# EAGLE design reflow_oven_TUE11_24_March_2023 (EAGLE 9.6.2)
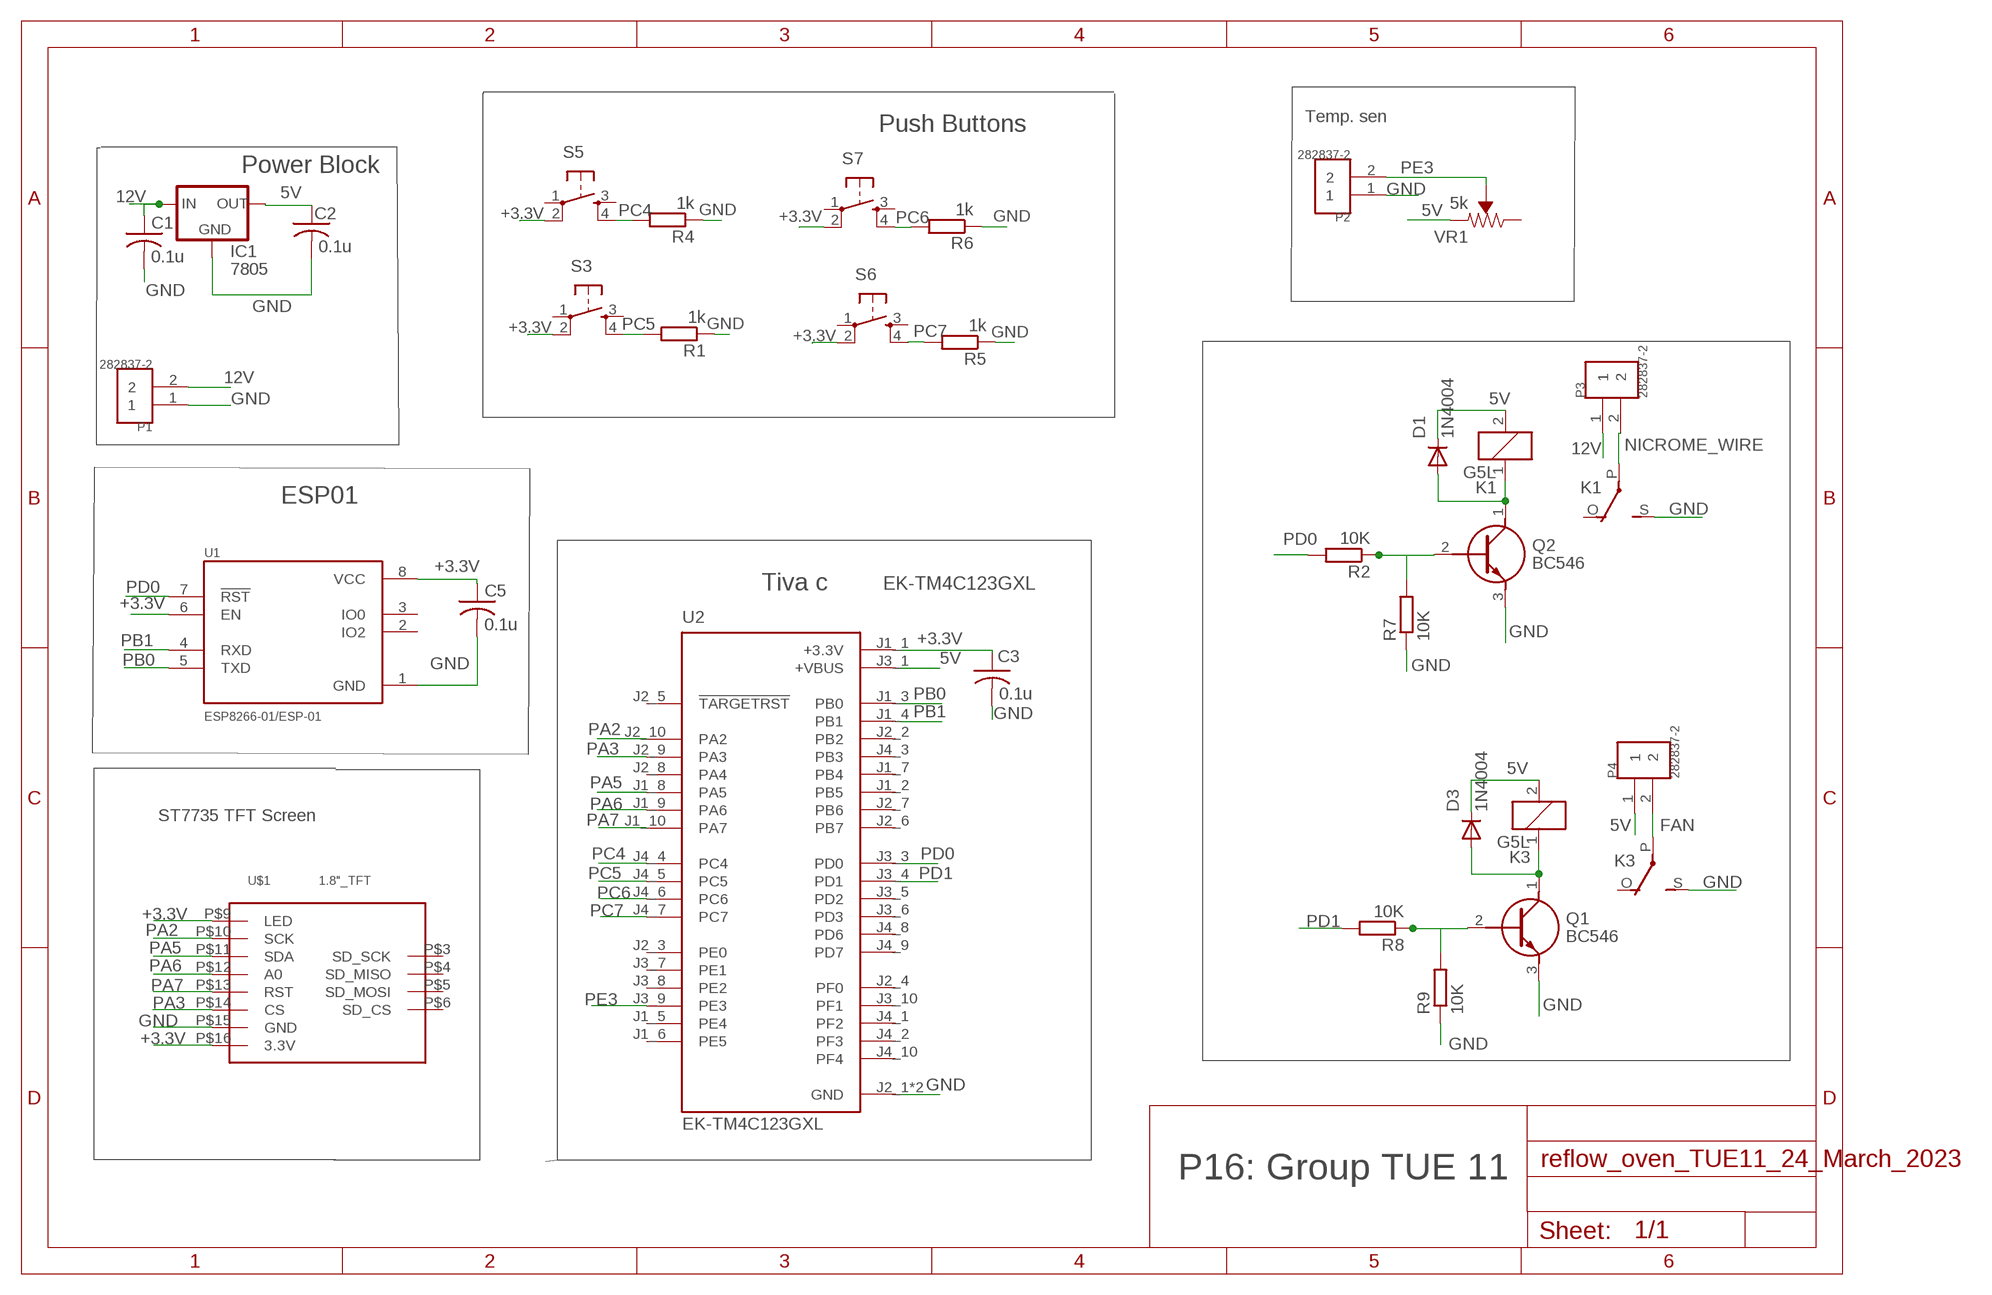
[diagram p0: schematic, sheet 1]

## Parts
C1  0.1u  C-USC1206  [C1206]
C2  0.1u  C-USC1206  [C1206]
C3  0.1u  C-USC1206  [C1206]
C5  0.1u  C-USC1206  [C1206]
D1  1N4004  [DO41-10]
D3  1N4004  [DO41-10]
IC1  7805  [78XXS]
K1  G5L  [G5LE]
K3  G5L  [G5LE]
P1  282837-2  [TE_282837-2]
P2  282837-2  [TE_282837-2]
P3  282837-2  [TE_282837-2]
P4  282837-2  [TE_282837-2]
Q1  BC546  [BC546]
Q2  BC546  [BC546]
R1  1k  R-EU_R1206  [R1206]
R2  10K  R-EU_R1206  [R1206]
R4  1k  R-EU_R1206  [R1206]
R5  1k  R-EU_R1206  [R1206]
R6  1k  R-EU_R1206  [R1206]
R7  10K  R-EU_R1206  [R1206]
R8  10K  R-EU_R1206  [R1206]
R9  10K  R-EU_R1206  [R1206]
S3  TAC_SWITCHPTH  [TACTILE-PTH]
S5  TAC_SWITCHPTH  [TACTILE-PTH]
S6  TAC_SWITCHPTH  [TACTILE-PTH]
S7  TAC_SWITCHPTH  [TACTILE-PTH]
U1  ESP8266-01/ESP-01  [XCVR_ESP8266-01/ESP-01]
U2  EK-TM4C123GXL  [MODULE_EK-TM4C123GXL]
U$1  1.8"_TFT  [1.8"_TFT]
VR1  5k  TRIMPOT-PTH-10MM-KNOB-1/2W-10%  [TRIMPOT-PTH-3386U]

## Nets
5V: C2.1 D1.C D3.C IC1.OUT K1.2 K3.2 P4.1 U2.J3_1(+VBUS) VR1.1(CCW)
12V: C1.1 IC1.IN P1.2 P3.1
+3.3V: C3.1 C5.1 S3.2 S5.2 S6.2 S7.2 U1.6(EN) U1.8(VCC) U2.J1_1(+3.3V) U$1.P$9(LED) U$1.P$16(3.3V)
FAN: K3.P(2:P) P4.2
GND: C1.2 C2.2 C3.2 C5.2 IC1.GND K1.S(2:S) K3.S(2:S) P1.1 P2.1 Q1.3(E) Q2.3(E) R1.1 R4.1 R5.1 R6.1 R7.1 R9.1 U1.1(GND) U2.J2_1(GND) U2.J3_2(GND) U$1.P$15(GND)
N$1: Q2.2(B) R2.1 R7.2
N$2: D1.A K1.1 Q2.1(C)
N$3: Q1.2(B) R8.1 R9.2
N$4: D3.A K3.1 Q1.1(C)
NICROME_WIRE: K1.P(2:P) P3.2
PA2: U2.J2_10(PA2) U$1.P$10(SCK)
PA3: U2.J2_9(PA3) U$1.P$14(CS)
PA5: U2.J1_8(PA5) U$1.P$11(SDA)
PA6: U2.J1_9(PA6) U$1.P$12(A0)
PA7: U2.J1_10(PA7) U$1.P$13(RST)
PB0: U1.5(TXD) U2.J1_3(PB0)
PB1: U1.4(RXD) U2.J1_4(PB1)
PC4: R4.2 S5.4 U2.J4_4(PC4)
PC5: R1.2 S3.4 U2.J4_5(PC5)
PC6: R6.2 S7.4 U2.J4_6(PC6)
PC7: R5.2 S6.4 U2.J4_7(PC7)
PD0: R2.2 U1.7(!RST) U2.J3_3(PD0)
PD1: R8.2 U2.J3_4(PD1)
PE3: P2.2 U2.J3_9(PE3) VR1.2(WIPER)
Unconnected: K1.O(2:O) K3.O(2:O) S3.1 S3.3 S5.1 S5.3 S6.1 S6.3 S7.1 S7.3 U1.2(IO2) U1.3(IO0) U2.J1_2(PB5) U2.J1_5(PE4) U2.J1_6(PE5) U2.J1_7(PB4) U2.J2_2(PB2) U2.J2_3(PE0) U2.J2_4(PF0) U2.J2_5(!TARGETRST) U2.J2_6(PB7) U2.J2_7(PB6) U2.J2_8(PA4) U2.J3_5(PD2) U2.J3_6(PD3) U2.J3_7(PE1) U2.J3_8(PE2) U2.J3_10(PF1) U2.J4_1(PF2) U2.J4_2(PF3) U2.J4_3(PB3) U2.J4_8(PD6) U2.J4_9(PD7) U2.J4_10(PF4) U$1.P$3(SD_SCK) U$1.P$4(SD_MISO) U$1.P$5(SD_MOSI) U$1.P$6(SD_CS) VR1.3(CW)

## Notes on the sheet
- Temp. sen
- Push Buttons
- Power Block
- ESP01
- Tiva c | EK-TM4C123GXL
- ST7735 TFT Screen
- P16: Group TUE 11

## Library data of the parts
C1-C3 C5 = adafruit:C-US: CAPACITOR, American symbol
D1 D3 = adafruit:1N4004: DIODE General purpose 1N400x type rectifier (With bigger pads) http://www.ladyada.net/library/pcb/eaglelibrary.html
IC1 = BASIC_Components:7805
K1 K3 = relay:G5L: RELAY 1 x switch, 10 A/120 V AC, 8 A/30 V ADC, Omron; OC_FARNELL: unknown; OC_NEWARK: unknown
P1-P4 = 282837-2:282837-2: TERM BLOCK 5.08MM 2POS SIDE ENTY Check availability <https://pricing.snapeda.com/parts/282837-2/TE%20Connectivity/view-part?ref=eda>; AVAILABILITY: In Stock; COMMENT: 282837-2; DESCRIPTION: Connector Terminal Blocks Receptacle 2 Position 5.08mm Solder Straight Thru-Hole 13.5A/Contact; MF: TE Connectivity; MP: 282837-2; PACKAGE: None; PRICE: None; PURCHASE-URL: https://pricing.snapeda.com/search/part/282837-2/?ref=eda
Q1 Q2 = BC546:BC546: TRANSISTOR, NPN, TO-92 Source: Datasheet <https://www.onsemi.com/pdf/datasheet/bc550-d.pdf>; DESCRIPTION: TRANSISTOR, NPN, TO-92; HEIGHT: 5.33mm; MANUFACTURER_NAME: onsemi; MANUFACTURER_PART_NUMBER: BC546; MOUSER_PART_NUMBER: 512-BC546; MOUSER_PRICE-STOCK: https://www.mouser.co.uk/ProductDetail/onsemi-Fairchild/BC546?qs=UMEuL5FsraDWGn9zuahUkw%3D%3D
R1 R2 R4-R9 = IIT_BOMBAY_Racing2:R-EU_: RESISTOR, European symbol
S3 S5-S7 = SparkFun-Retired:TAC_SWITCH: Momentary Switch Button commonly used for reset or general input. Spark Fun Electronics SKU : COM-00097 SMT- SWCH-08247
U1 = ESP8266-01_ESP-01:ESP8266-01/ESP-01: MakerFocus 4pcs ESP8266 ESP-01 Serial Wireless WiFi Transceiver Receiver Module 1MB SPI Flash DC3.0-3.6V Internet of Things WiFi Module Board Compatible with Ar duino Check availability <https://pricing.snapeda.com/parts/ESP8266-01/ESP-01/AI-Thinker/view-part?ref=eda>; AVAILABILITY: Not in stock; DESCRIPTION: MakerFocus 4pcs ESP8266 ESP-01 Serial Wireless WiFi Transceiver Receiver Module 1MB SPI Flash DC3.0-3.6V Internet of Things WiFi Module Board Compatible with Ar duino; MF: AI-Thinker; MP: ESP8266-01/ESP-01; PACKAGE: Non-Standard AI-Thinker; PRICE: None
U2 = EK-TM4C123GXL:EK-TM4C123GXL: ARM® Cortex®-M4F Based MCU TM4C123G LaunchPad™ Evaluation Kit Check availability <https://pricing.snapeda.com/parts/EK-TM4C123GXL/Texas%20Instruments/view-part?ref=eda>; AVAILABILITY: In Stock; DESCRIPTION: ARM® Cortex®-M4F Based MCU TM4C123G LaunchPad™ Evaluation Kit; MF: Texas Instruments; MP: EK-TM4C123GXL; PACKAGE: None; PRICE: None; PURCHASE-URL: https://pricing.snapeda.com/search/part/EK-TM4C123GXL/?ref=eda
U$1 = tft_1_8_1_44_oled_0_96:1.8"_TFT
VR1 = SparkFun-Resistors:TRIMPOT: Trimming Potentiometer (Trimpot) Three-terminal potentiometers, with an adjustable wiper and two adjustable resistors. A pot can be used to create a configurable voltage divider, or as a variable resistor. "Trimpots" are a subset of potentiometers, usually intended for "set-and-forget" applications. They're often more delicate than standard potentiometers - rated for fewer turns. Variants PTH-KNOB - PTH Trimpot w/ finger-adjustable knob Trimpot 10K with Knob <https://www.sparkfun.com/products/9806> (COM-09806) Datasheet <http://www.sparkfun.com/datasheets/Components/General/TSR-3386.pdf> SMD-3MM-CLOSED-FRAME - SMD 3mm Square Closed-Frame Trimpot Used on e.g. EasyDriver - Stepper Motor Driver <https://www.sparkfun.com/products/12779> Datasheet <http://www.bitechnologies.com/pdfs/22.pdf> (22AR10KTR) SMD-5MM - SMD 5mm Square Closed-Frame Trimpot Used on e.g. IOIO-OTG - V2.2 <https://www.sparkfun.com/products/13613> Datasheet <http://www.vishay.com/docs/51008/ts53.pdf> (TS53YL502MR10) SMD-3MM-1/10W-25% - 3mm Square Open-Frame Trimpot Used on e.g. SparkFun Shapeoko <https://www.sparkfun.com/products/13899> Datasheet <http://www.bourns.com/docs/Product-Datasheets/TC33.pdf> (TC33X-2-103E); PROD_ID: RES-09730; SF_SKU: COM-09806; VALUE: 10k

## Board
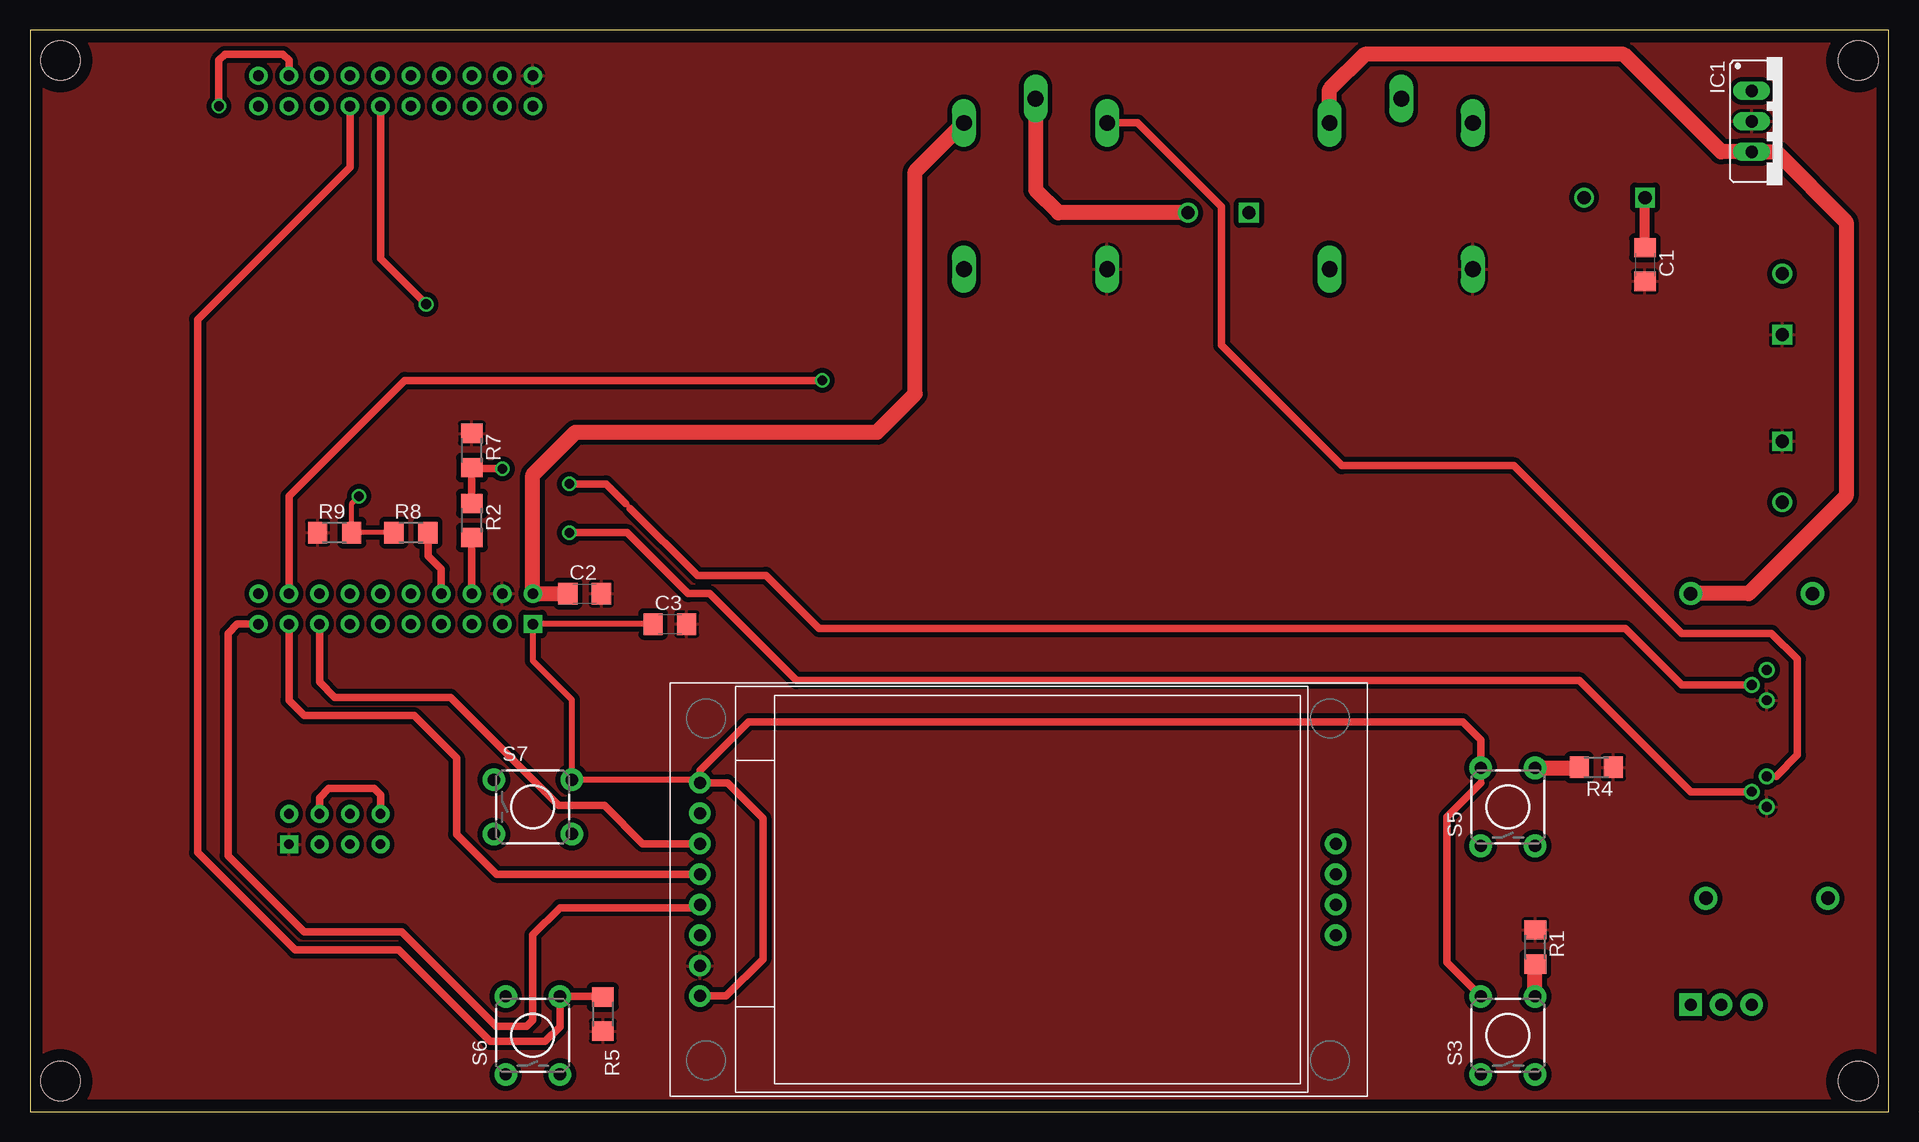
[diagram p1: board, top side]
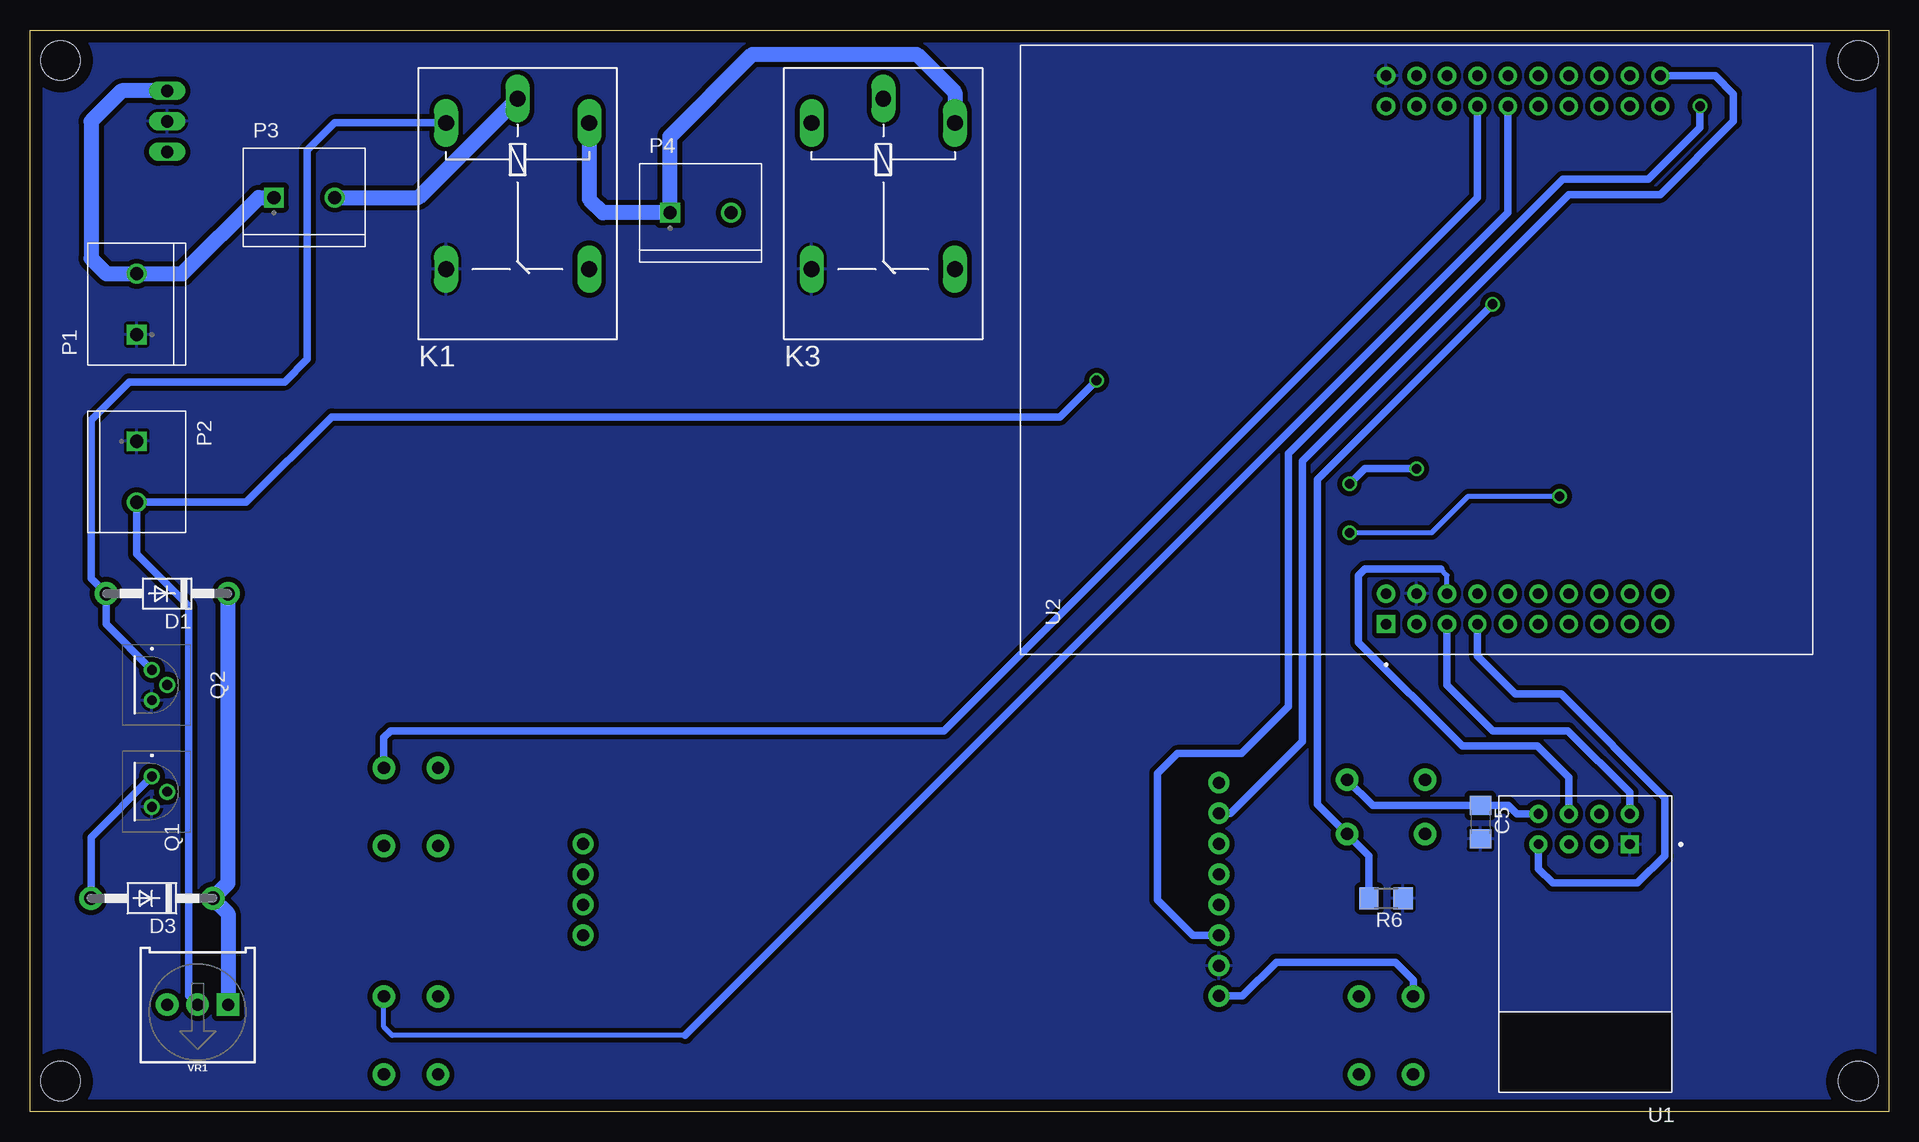
[diagram p2: board, bottom side, seen from below]

Size 154.95 x 90.17 mm. Coordinates in mm from the lower left corner, seen from the top.
Outline: 0,0 154.94,0 154.94,90.17 0,90.17 0,0
Copper layers (1*16): Top 0.035mm / dielectric 1.5mm / Bottom 0.035mm
Design rules "PCB_Power *": minimum track width 16mil, minimum drill 0.8mm, track to track 16mil, track to pad 16mil, pad to pad 16mil, via to via 16mil, smd to smd 16mil, copper to edge 40mil, drill to drill 20mil, minimum pad ring 10mil, minimum via ring 8mil, stop-mask expansion 4mil, vias tented up to drill 0mil, thermal gap 10mil
Holes 3.3 mm at 2.54,2.54 2.54,87.63 152.4,87.63 152.4,2.54

### Footprints (pad centres in the part's own frame; a part is rotated, then mirrored left to right if it is on the bottom)
C1206 = smd 1.6 x 1.8: 1 -1.4,0; 2 1.4,0
DO41-10 = drill 1.118 pad 1.93: A 5.08,0; C -5.08,0
78XXS = drill 1.016 long: GND 0,-2.54; IN -2.54,-2.54; OUT 2.54,-2.54
G5LE = drill 1.321 long: 1 -7.493,-5.969; 2 -7.493,5.969; O 4.699,5.969; P -9.525,0; S 4.699,-5.969
TE_282837-2 = drill 1.1 square: 1 -2.54,0 | drill 1.1: 2 2.54,0
BC546 = drill 0.82 pad 1.333: 1 0,0; 2 1.27,1.27; 3 2.54,0
R1206 = smd 1.6 x 1.803: 1 -1.422,0; 2 1.422,0
TACTILE-PTH = drill 1.016 pad 1.88: 1 -3.251,2.261; 2 3.251,2.261; 3 -3.251,-2.261; 4 3.251,-2.261
XCVR_ESP8266-01/ESP-01 = drill 0.8 pad 1.5 square: 1 -3.81,-8.31 | drill 0.8 pad 1.5: 2 -1.27,-8.31; 3 1.27,-8.31; 4 3.81,-8.31; 5 -3.81,-10.85; 6 -1.27,-10.85; 7 1.27,-10.85; 8 3.81,-10.85
MODULE_EK-TM4C123GXL = drill 0.89 pad 1.52 square: J1_1 -22.86,2.54 | drill 0.89 pad 1.52: J1_2 -22.86,0; J1_3 -22.86,-2.54; J1_4 -22.86,-5.08; J1_5 -22.86,-7.62; J1_6 -22.86,-10.16; J1_7 -22.86,-12.7; J1_8 -22.86,-15.24; J1_9 -22.86,-17.78; J1_10 -22.86,-20.32; J2_1 22.86,2.54; J2_2 22.86,0; J2_3 22.86,-2.54; J2_4 22.86,-5.08; J2_5 22.86,-7.62; J2_6 22.86,-10.16; J2_7 22.86,-12.7; J2_8 22.86,-15.24; J2_9 22.86,-17.78; J2_10 22.86,-20.32; J3_1 -20.32,2.54; J3_2 -20.32,0; J3_3 -20.32,-2.54; J3_4 -20.32,-5.08; J3_5 -20.32,-7.62; J3_6 -20.32,-10.16; J3_7 -20.32,-12.7; J3_8 -20.32,-15.24; J3_9 -20.32,-17.78; J3_10 -20.32,-20.32; J4_1 20.32,2.54; J4_2 20.32,0; J4_3 20.32,-2.54; J4_4 20.32,-5.08; J4_5 20.32,-7.62; J4_6 20.32,-10.16; J4_7 20.32,-12.7; J4_8 20.32,-15.24; J4_9 20.32,-17.78; J4_10 20.32,-20.32
1.8"_TFT = drill 1 pad 1.778: P$3 55.5,21.05; P$4 55.5,18.52; P$5 55.5,15.98; P$6 55.5,13.44; P$9 2.5,26.14; P$10 2.5,23.6; P$11 2.5,21.06; P$12 2.5,18.52; P$13 2.5,15.98; P$14 2.5,13.44; P$15 2.5,10.9; P$16 2.5,8.36
TRIMPOT-PTH-3386U = drill 1.016 pad 1.88 square: 1 -2.54,-0.015 | drill 1.016 pad 1.88: 2 0,-0.015; 3 2.54,-0.015

### Placement (x,y rotation side)
C1  134.62,70.61 270 top
C2  46.23,43.18 0 top
C3  53.34,40.64 0 top
C5  34.04,24.13 270 bottom
D1  143.51,43.18 180 bottom
D3  144.78,17.78 180 bottom
IC1  146.05,82.55 270 top
K1  114.3,74.93 270 bottom
K3  83.82,74.93 270 bottom
P1  146.05,67.31 90 bottom
P2  146.05,53.34 270 bottom
P3  132.08,76.2 0 bottom
P4  99.06,74.93 0 bottom
Q1  144.78,27.94 270 bottom
Q2  144.78,36.83 270 bottom
R1  125.48,13.72 270 top
R2  36.83,49.28 270 top
R4  130.56,28.7 180 top
R5  47.75,8.13 90 top
R6  41.91,17.78 180 bottom
R7  36.83,55.12 270 top
R8  31.75,48.26 0 top
R9  25.4,48.26 0 top
S3  123.19,6.35 90 top
S5  123.19,25.4 90 top
S6  41.91,6.35 90 top
S7  41.91,25.4 0 top
U1  25.4,13.97 180 bottom
U2  39.37,63.5 90 bottom
U$1  53.34,1.27 0 top
VR1  140.97,8.89 180 bottom

### Tracks (layer width: path | path; a pad name or v marks a point on that pad's centre or on a via)
5V
  Top 1.27: K1.2 108.33,85.22 111.25,88.14 132.84,88.14 140.97,80.01 IC1.OUT 145.54,80.01 151.38,74.17 151.38,51.31 143.26,43.18 D1.C | K3.2 73.79,78.36 73.79,59.82 70.61,56.64 45.47,56.64 41.91,53.09 U2.J3_1 C2.1
  Bottom 1.27: VR1.1 138.43,16.51 D3.C 138.43,19.05 D1.C | K3.2 77.85,84.96 81.03,88.14 94.74,88.14 101.6,81.28 P4.1 107.19,74.93 108.33,76.07 K1.2
12V
  Top 0.813: C1.1 P3.1
  Bottom 1.27: P3.1 135.89,76.2 142.24,69.85 P1.2 148.59,69.85 149.86,71.12 149.86,82.55 147.32,85.09 IC1.IN
+3.3V
  Top 0.406: U$1.P$9 55.59,27.66
  Top 0.508: 55.59,27.66 S7.2 45.16,34.34 41.91,37.59 U2.J1_1 C3.1 | S5.2 120.93,27.38
  Top 0.61: S3.2 118.11,12.42 118.11,24.56 120.93,27.38 | U$1.P$16 58.02,9.63 61.09,12.7 61.09,24.45 58.13,27.41 U$1.P$9 55.84,28.43 59.9,32.49 119.43,32.49 120.93,31 S5.2 | U1.6 24.13,26.16 24.89,26.92 28.7,26.92 29.21,26.42 U1.8
  Bottom 0.406: 43.03,25.53
  Bottom 0.61: 43.03,25.53 S7.2 | U1.8 30.99,24.82 31.7,25.53 C5.1 43.03,25.53 | S6.2 39.65,10.95 41.15,12.45 51.05,12.45 53.87,9.63 U$1.P$16
FAN
  Top 1.27: P4.2 85.73,74.93 83.82,76.84 K3.P
GND
  pour Top: 11.43,107.95 -5.08,91.44 -5.08,0 3.81,-8.89 154.94,-8.89 167.64,3.81 167.64,102.87 162.56,107.95
  pour Bottom: 11.43,106.68 -5.08,90.17 -5.08,0 2.54,-7.62 153.67,-7.62 163.83,2.54 163.83,102.87 160.02,106.68
N$1  (via drill 0.8)
  Top 0.406: 49.63,50.7 50.04,50.29 | R7.2 36.93,53.59
  Top 0.61: Q2.2 137.67,35.56 132.97,40.26 65.79,40.26 61.34,44.7 55.63,44.7 50.04,50.29 | R7.2 R2.1 | 36.93,53.59 v39.37,53.59 | v44.96,52.32 48.01,52.32 49.63,50.7
  Bottom 0.61: v39.37,53.59 43.69,53.59 v44.96,52.32
N$2
  Bottom 0.61: Q2.1 148.59,40.64 D1.A 149.86,44.45 149.86,57.66 146.69,60.83 133.73,60.83 131.83,62.74 131.83,80.14 129.54,82.42 K1.1
N$3  (via drill 0.8)
  Top 0.406: R8.1 R9.2 26.82,50.7 v27.43,51.31
  Top 0.61: Q1.2 138.43,26.67 129.16,35.94 63.88,35.94 56.64,43.18 54.86,43.18 49.78,48.26 v44.96,48.26
  Bottom 0.406: v44.96,48.26 38.1,48.26 35.05,51.31 v27.43,51.31
N$4
  Top 0.406: Q1.1 145.54,27.94
  Top 0.61: 145.54,27.94 147.32,29.72 147.32,37.72 145.16,39.88 137.67,39.88 123.7,53.85 109.35,53.85 99.31,63.88 99.31,75.44 92.33,82.42 K3.1
  Bottom 0.61: Q1.1 149.86,22.86 D3.A
NICROME_WIRE
  Bottom 1.27: P3.2 122.56,76.2 K1.P
PA2
  Bottom 0.406: 54.89,24.87 U$1.P$10
  Bottom 0.61: 54.89,24.87 48.89,30.86 48.89,54.23 26.67,76.45 19.05,76.45 12.95,82.55 12.95,84.84 14.48,86.36 U2.J2_10
PA3  (via drill 0.8)
  Top 0.61: v15.75,83.82 15.75,87.63 16.26,88.14 21.08,88.14 21.59,87.63 U2.J2_9
  Bottom 0.61: U$1.P$14 58.02,14.71 60.96,17.65 60.96,28.19 59.31,29.84 53.98,29.84 50.04,33.78 50.04,54.86 27.18,77.72 20.07,77.72 15.75,82.04 v15.75,83.82
PA5
  Top 0.61: U$1.P$11 51.08,22.33 47.88,25.53 44.07,25.53 35.05,34.54 25.4,34.54 24.13,35.81 U2.J1_8
PA6
  Top 0.61: U$1.P$12 38.88,19.79 35.56,23.11 35.56,29.46 32,33.02 22.86,33.02 21.59,34.29 U2.J1_9
PA7
  Top 0.61: U$1.P$13 55.59,17 44.17,17 41.91,14.73 41.91,7.62 41.4,7.11 38.86,7.11 30.99,14.99 22.86,14.99 16.51,21.34 16.51,39.88 17.27,40.64 U2.J1_10
PB0
  Bottom 0.61: U1.5 21.59,26.6 26.74,31.75 33.02,31.75 36.83,35.56 U2.J1_3
PB1
  Bottom 0.61: U1.4 29.21,20.25 28.01,19.05 20.95,19.05 18.67,21.34 18.67,26.16 27.31,34.8 31.11,34.8 34.29,37.97 U2.J1_4
PC4
  Top 1.27: S5.4 129.08,28.65 R4.2
  Bottom 0.61: U2.J4_4 34.29,76.2 78.74,31.75 124.89,31.75 125.45,31.19 S5.4
PC5
  Top 1.27: S3.4 125.45,12.27 R1.2
  Bottom 0.406: S3.4 125.45,7.06 124.74,6.35 100.33,6.35
  Bottom 0.61: U2.J4_5 31.75,74.93 100.33,6.35
PC6  (via drill 0.81)
  Top 0.61: U2.J4_6 29.21,71.12 v33.02,67.31
  Bottom 0.61: R6.2 43.33,21.31 S7.4 47.62,25.6 47.62,52.7 v33.02,67.31
PC7
  Top 0.406: 47.7,9.6 R5.2
  Top 0.61: U2.J4_7 26.67,78.74 13.97,66.04 13.97,21.59 22.1,13.46 30.73,13.46 38.35,5.84 42.93,5.84 44.17,7.09 S6.4 47.7,9.6
PD0
  Top 0.61: R2.2 U2.J3_3
  Bottom 0.406: U2.J3_3 36.83,44.7 37.34,45.21
  Bottom 0.61: U1.7 26.67,27.87 29.28,30.48 35.56,30.48 44.2,39.12 44.2,44.7 43.69,45.21 37.34,45.21
PD1
  Top 0.61: U2.J3_4 34.29,45.21 33.17,46.33 R8.2
PE3  (via drill 0.81)
  Top 0.61: U2.J3_9 21.59,51.31 31.24,60.96 v66.04,60.96
  Bottom 0.406: VR1.2 141.73,9.67
  Bottom 0.61: 141.73,9.67 141.73,42.16 146.05,46.48 P2.2 136.91,50.8 129.79,57.91 69.09,57.91 v66.04,60.96